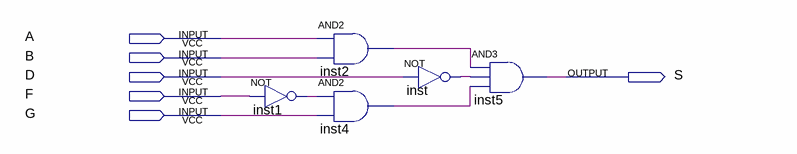
[diagram p0: schematic sheet]
// Quartus schematic Block8.bdf as structural Verilog: 5 symbols, 6 pins
module Block8 (
  input  A,
  input  B,
  input  D,
  input  F,
  input  G,
  output S
);

  wire inst1_out, inst2_out, inst4_out, inst_out;

  not inst1 (inst1_out, F);
  and inst2 (inst2_out, A, B);
  and inst4 (inst4_out, inst1_out, G);
  not inst (inst_out, D);
  and inst5 (S, inst2_out, inst_out, inst4_out);
endmodule
